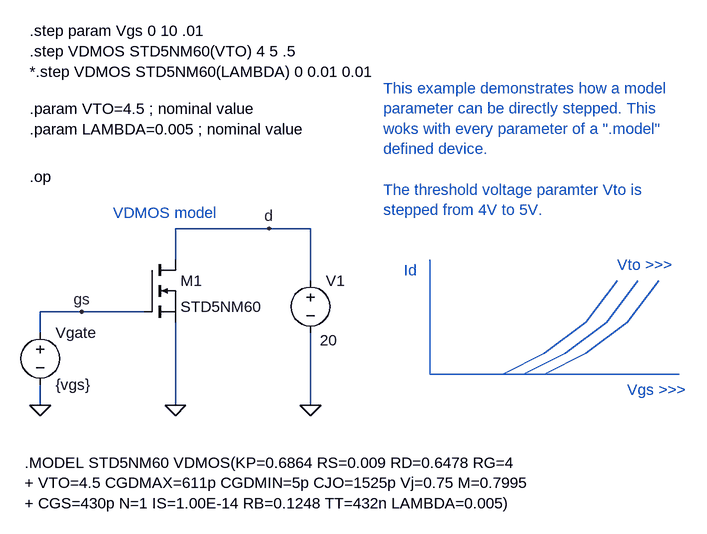
[diagram p0: schematic mos_model_param_sweep1.asc]
mos_model_param_sweep1.asc, the LTspice schematic file:
Version 4
SHEET 1 2828 1468
WIRE 256 400 112 400
WIRE 320 400 256 400
WIRE 112 448 112 400
WIRE 320 480 320 400
WIRE -32 528 -96 528
WIRE 64 528 -32 528
WIRE -96 560 -96 528
WIRE -96 672 -96 640
WIRE 112 672 112 544
WIRE 320 672 320 560
FLAG -96 672 0
FLAG 112 672 0
FLAG -32 528 gs
FLAG 256 400 d
FLAG 320 672 0
SYMBOL voltage -96 544 R0
WINDOW 123 0 0 Left 0
WINDOW 39 0 0 Left 0
SYMATTR InstName Vgate
SYMATTR Value {vgs}
SYMBOL voltage 320 464 R0
WINDOW 123 0 0 Left 0
WINDOW 39 0 0 Left 0
WINDOW 3 15 108 Left 0
SYMATTR Value 20
SYMATTR InstName V1
SYMBOL NMOS 64 448 R0
SYMATTR InstName M1
SYMATTR Value STD5NM60
TEXT 464 464 Left 0 ;Id
TEXT 808 648 Left 0 ;Vgs >>>
TEXT 16 376 Left 0 ;VDMOS model
TEXT -112 96 Left 0 !.step param Vgs 0 10 .01\n.step VDMOS STD5NM60(VTO) 4 5 .5\n*.step VDMOS STD5NM60(LAMBDA) 0 0.01 0.01
TEXT -120 760 Left 0 !.MODEL STD5NM60 VDMOS(KP=0.6864 RS=0.009 RD=0.6478 RG=4\n+ VTO=4.5 CGDMAX=611p CGDMIN=5p CJO=1525p Vj=0.75 M=0.7995\n+ CGS=430p N=1 IS=1.00E-14 RB=0.1248 TT=432n LAMBDA=0.005)
TEXT 792 456 Left 0 ;Vto >>>
TEXT -112 320 Left 0 !.op
TEXT 432 184 Left 0 ;This example demonstrates how a model \nparameter can be directly stepped. This \nwoks with every parameter of a ".model" \ndefined device.\n \nThe threshold voltage paramter Vto is \nstepped from 4V to 5V.
TEXT -112 216 Left 0 !.param VTO=4.5 ; nominal value\n.param LAMBDA=0.005 ; nominal value
LINE Normal 504 624 504 448
LINE Normal 888 624 504 624
LINE Normal 624 624 512 624
LINE Normal 680 592 616 624
LINE Normal 712 592 648 624
LINE Normal 744 592 680 624
LINE Normal 744 544 680 592
LINE Normal 792 480 744 544
LINE Normal 776 544 712 592
LINE Normal 824 480 776 544
LINE Normal 808 544 744 592
LINE Normal 856 480 808 544

The netlist it stands for:
* mos_model_param_sweep1.asc
Vgate gs 0 {vgs}
V1 d 0 20
M1 d gs 0 0 STD5NM60
.model NMOS NMOS
.model PMOS PMOS
.lib standard.mos
* Id
* Vgs >>>
* VDMOS model
.step param Vgs 0 10 .01
.step VDMOS STD5NM60(VTO) 4 5 .5
*.step VDMOS STD5NM60(LAMBDA) 0 0.01 0.01
.MODEL STD5NM60 VDMOS(KP=0.6864 RS=0.009 RD=0.6478 RG=4
+ VTO=4.5 CGDMAX=611p CGDMIN=5p CJO=1525p Vj=0.75 M=0.7995
+ CGS=430p N=1 IS=1.00E-14 RB=0.1248 TT=432n LAMBDA=0.005)
* Vto >>>
.op
* This example demonstrates how a model
* parameter can be directly stepped. This
* woks with every parameter of a ".model"
* defined device.
* The threshold voltage paramter Vto is
* stepped from 4V to 5V.
.param VTO=4.5 ; nominal value
.param LAMBDA=0.005 ; nominal value
.backanno
.end